# EAGLE design ArduinoShield101 (EAGLE 7.6.0)
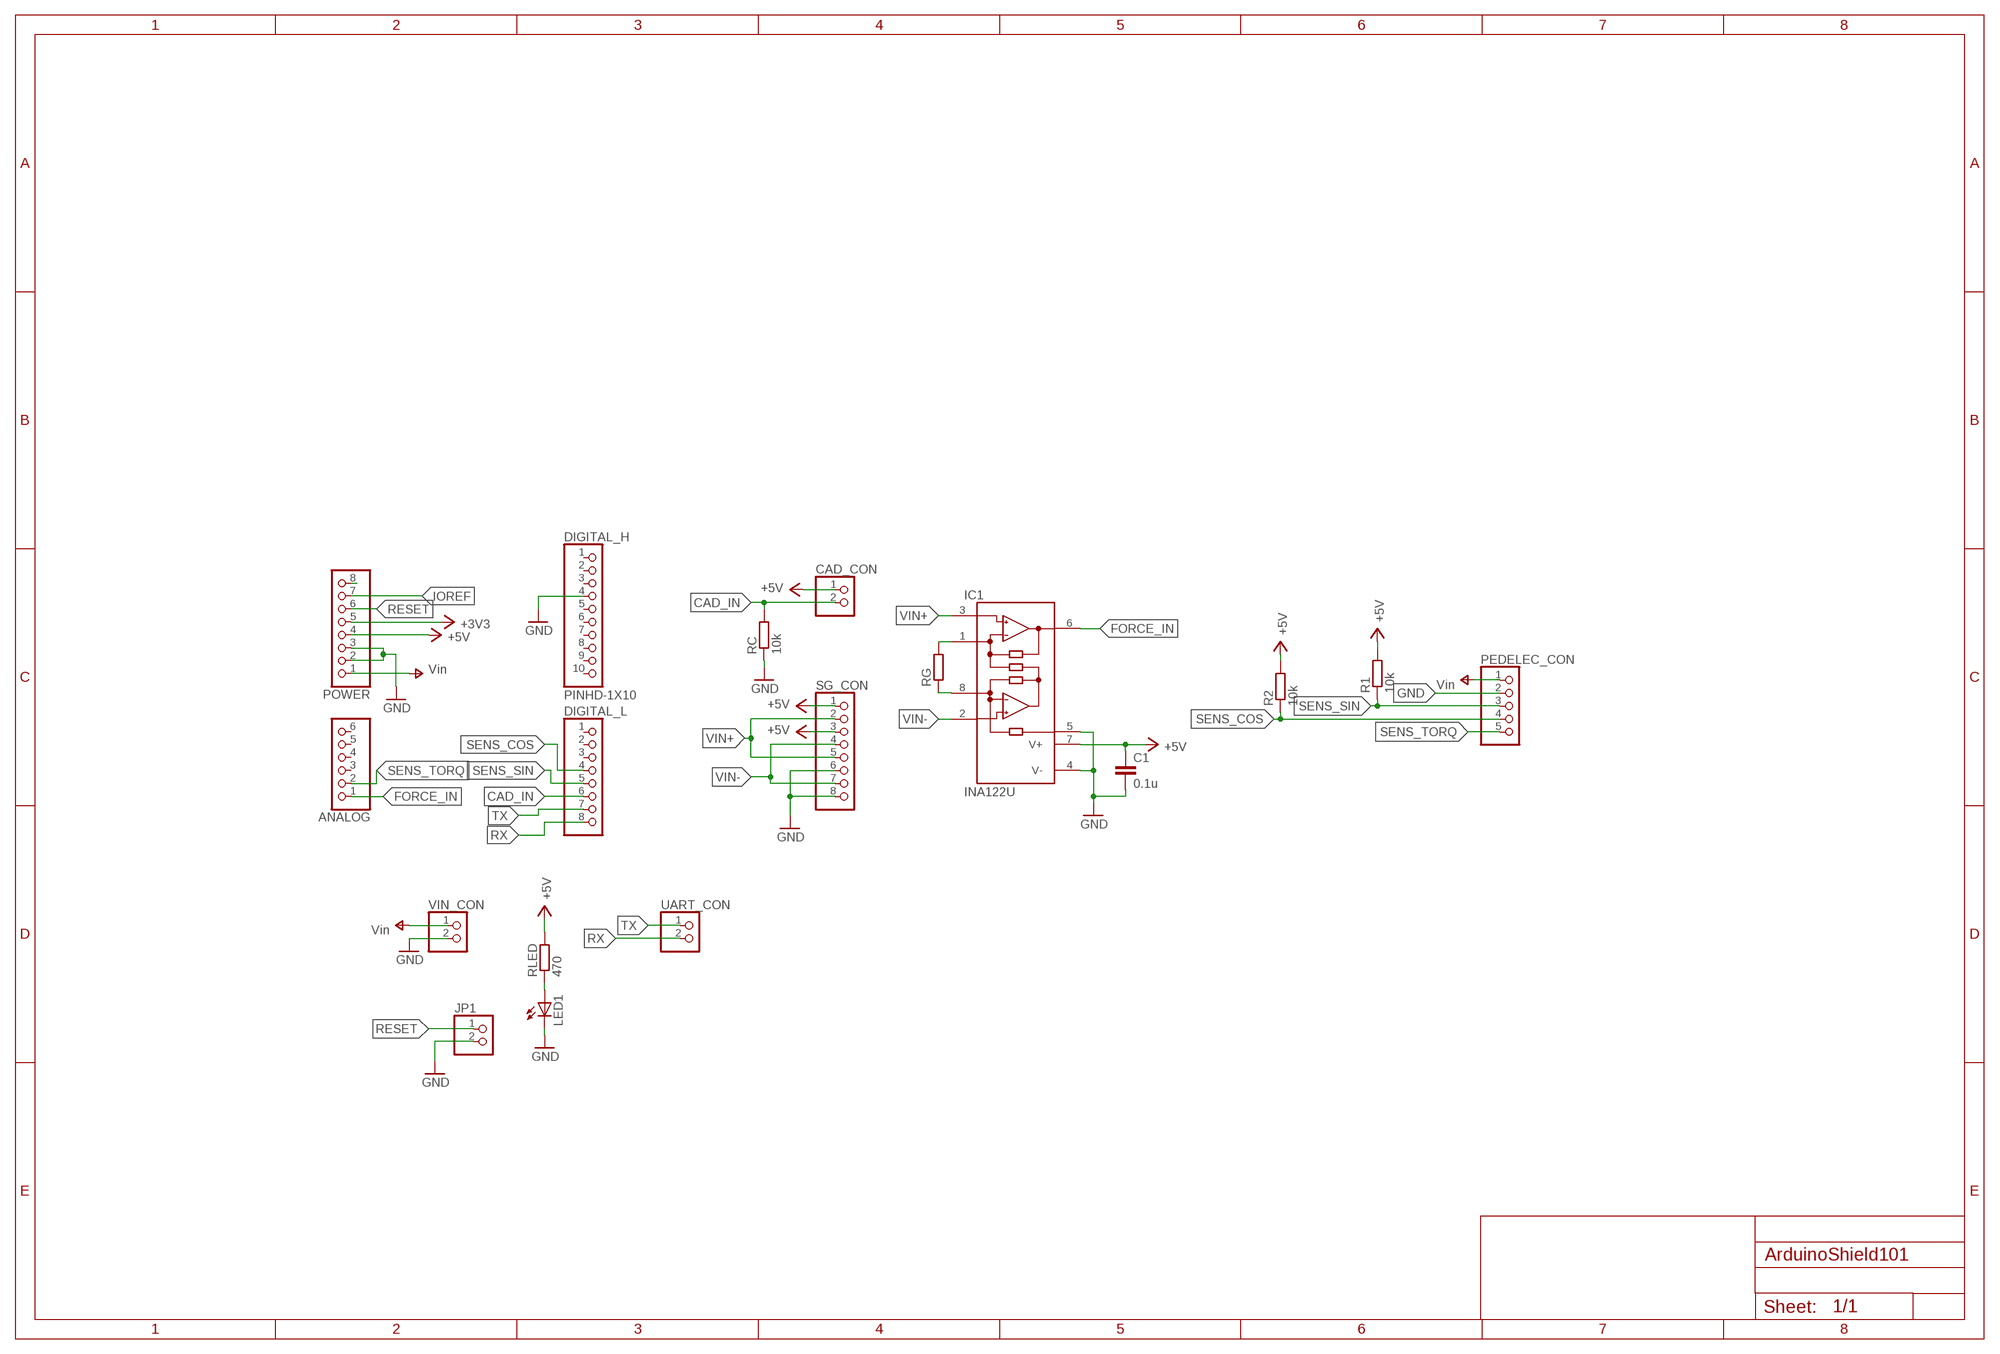
[diagram p0: schematic, sheet 1]

## Parts
ANALOG  PINHD-1X6B  [1X06-BIG]
C1  0.1u  C-EUC0603  [C0603]
CAD_CON  PINHD-1X2/90  [1X02/90]
DIGITAL_H  PINHD-1X10  [1X10-BIG]
DIGITAL_L  PINHD-1X8BIG  [1X08-BIG]
IC1  INA122U  [SO08]
JP1  PINHD-1X2  [1X02]
LED1  LEDCHIPLED_0603  [CHIPLED_0603]
PEDELEC_CON  PINHD-1X5/90  [1X05/90]
POWER  PINHD-1X8BIG  [1X08-BIG]
R1  10k  R-EU_R0603  [R0603]
R2  10k  R-EU_R0603  [R0603]
RC  10k  R-EU_R0603  [R0603]
RG  R-EU_R0603  [R0603]
RLED  470  R-EU_R0603  [R0603]
SG_CON  PINHD-1X8/90  [1X08/90]
UART_CON  PINHD-1X2/90  [1X02/90]
VIN_CON  PINHD-1X2/90  [1X02/90]

## Nets
+3V3: POWER.5
+5V [usbvcc]: C1.1 CAD_CON.1 IC1.7(V+) POWER.4 R1.2 R2.2 RLED.2 SG_CON.1 SG_CON.3
CAD_IN: CAD_CON.2 DIGITAL_L.6 RC.2
FORCE_IN: ANALOG.1 IC1.6(OUT)
GND: C1.2 DIGITAL_H.4 IC1.4(V-) IC1.5(REF) JP1.2 LED1.C PEDELEC_CON.2 POWER.2 POWER.3 RC.1 SG_CON.6 SG_CON.8 VIN_CON.2
IOREF: POWER.7
N$1: POWER.8
N$2: IC1.1(RG) RG.2
N$3: IC1.8(RG) RG.1
N$4: LED1.A RLED.1
RESET: JP1.1 POWER.6
RX: DIGITAL_L.8 UART_CON.2
SENS_COS: DIGITAL_L.4 PEDELEC_CON.4 R2.1
SENS_SIN: DIGITAL_L.5 PEDELEC_CON.3 R1.1
SENS_TORQ: ANALOG.2 PEDELEC_CON.5
TX: DIGITAL_L.7 UART_CON.1
V+ [power]: PEDELEC_CON.1 POWER.1 VIN_CON.1 ; supply symbol labelled Vin
VIN+: IC1.3(+IN) SG_CON.2 SG_CON.5
VIN-: IC1.2(-IN) SG_CON.4 SG_CON.7
Unconnected: ANALOG.3 ANALOG.4 ANALOG.5 ANALOG.6 DIGITAL_H.1 DIGITAL_H.2 DIGITAL_H.3 DIGITAL_H.5 DIGITAL_H.6 DIGITAL_H.7 DIGITAL_H.8 DIGITAL_H.9 DIGITAL_H.10 DIGITAL_L.1 DIGITAL_L.2 DIGITAL_L.3

## Library data of the parts
ANALOG = adafruit:PINHD-1X6: PIN HEADER
C1 = rcl:C-EU: CAPACITOR, European symbol
CAD_CON JP1 UART_CON VIN_CON = pinhead:PINHD-1X2: PIN HEADER
DIGITAL_H = adafruit:PINHD-1X10: Pin header 1x10 0.1" spacing With round pins
DIGITAL_L POWER = adafruit:PINHD-1X8: PIN HEADER
IC1 = burr-brown:INA122: Instrumentation Amplifier Single Supply, MicroPower; MPN: INA122U; OC_FARNELL: 1212407; OC_NEWARK: 97K1918
LED1 = adafruit:LED: LED OSRAM: - CHIPLED LG R971, LG N971, LY N971, LG Q971, LY Q971, LO R971, LY R971 LH N974, LH R974 LS Q976, LO Q976, LY Q976 LO Q996 - Hyper CHIPLED LW Q18S LB Q993, LB Q99A, LB R99A - SideLED LS A670, LO A670, LY A670, LG A670, LP A670 LB A673, LV A673, LT A673, LW A673 LH A674 LY A675 LS A676, LA A676, LO A676, LY A676, LW A676 LS A679, LY A679, LG A679 - Hyper Micro SIDELED® LS Y876, LA Y876, LO Y876, LY Y876 LT Y87S - SmartLED LW L88C, LW L88S LB L89C, LB L89S, LG L890 LS L89K, LO L89K, LY L89K LS L896, LA L896, LO L896, LY L896 - TOPLED LS T670, LO T670, LY T670, LG T670, LP T670 LSG T670, LSP T670, LSY T670, LOP T670, LYG T670 LG T671, LOG T671, LSG T671 LB T673, LV T673, LT T673, LW T673 LH T674 LS T676, LA T676, LO T676, LY T676, LB T676, LH T676, LSB T676, LW T676 LB T67C, LV T67C, LT T67C, LS T67K, LO T67K, LY T67K, LW E67C LS E67B, LA E67B, LO E67B, LY E67B, LB E67C, LV E67C, LT E67C LW T67C LS T679, LY T679, LG T679 LS T770, LO T770, LY T770, LG T770, LP T770 LB T773, LV T773, LT T773, LW T773 LH T774 LS E675, LA E675, LY E675, LS T675 LS T776, LA T776, LO T776, LY T776, LB T776 LHGB T686 LT T68C, LB T68C - Hyper Mini TOPLED® LB M676 - Mini TOPLED Santana® LG M470 LS M47K, LO M47K, LY M47K Source: http://www.osram.convergy.de/
PEDELEC_CON = pinhead:PINHD-1X5: PIN HEADER
R1 R2 RC RG RLED = rcl:R-EU_: RESISTOR, European symbol
SG_CON = pinhead:PINHD-1X8: PIN HEADER

## Net classes
0 default: width 0.203 mm, drill 0.305 mm, clearance 0.203 mm
3 usbvcc: width 0.203 mm, drill 0.305 mm, clearance 0.203 mm

## Board
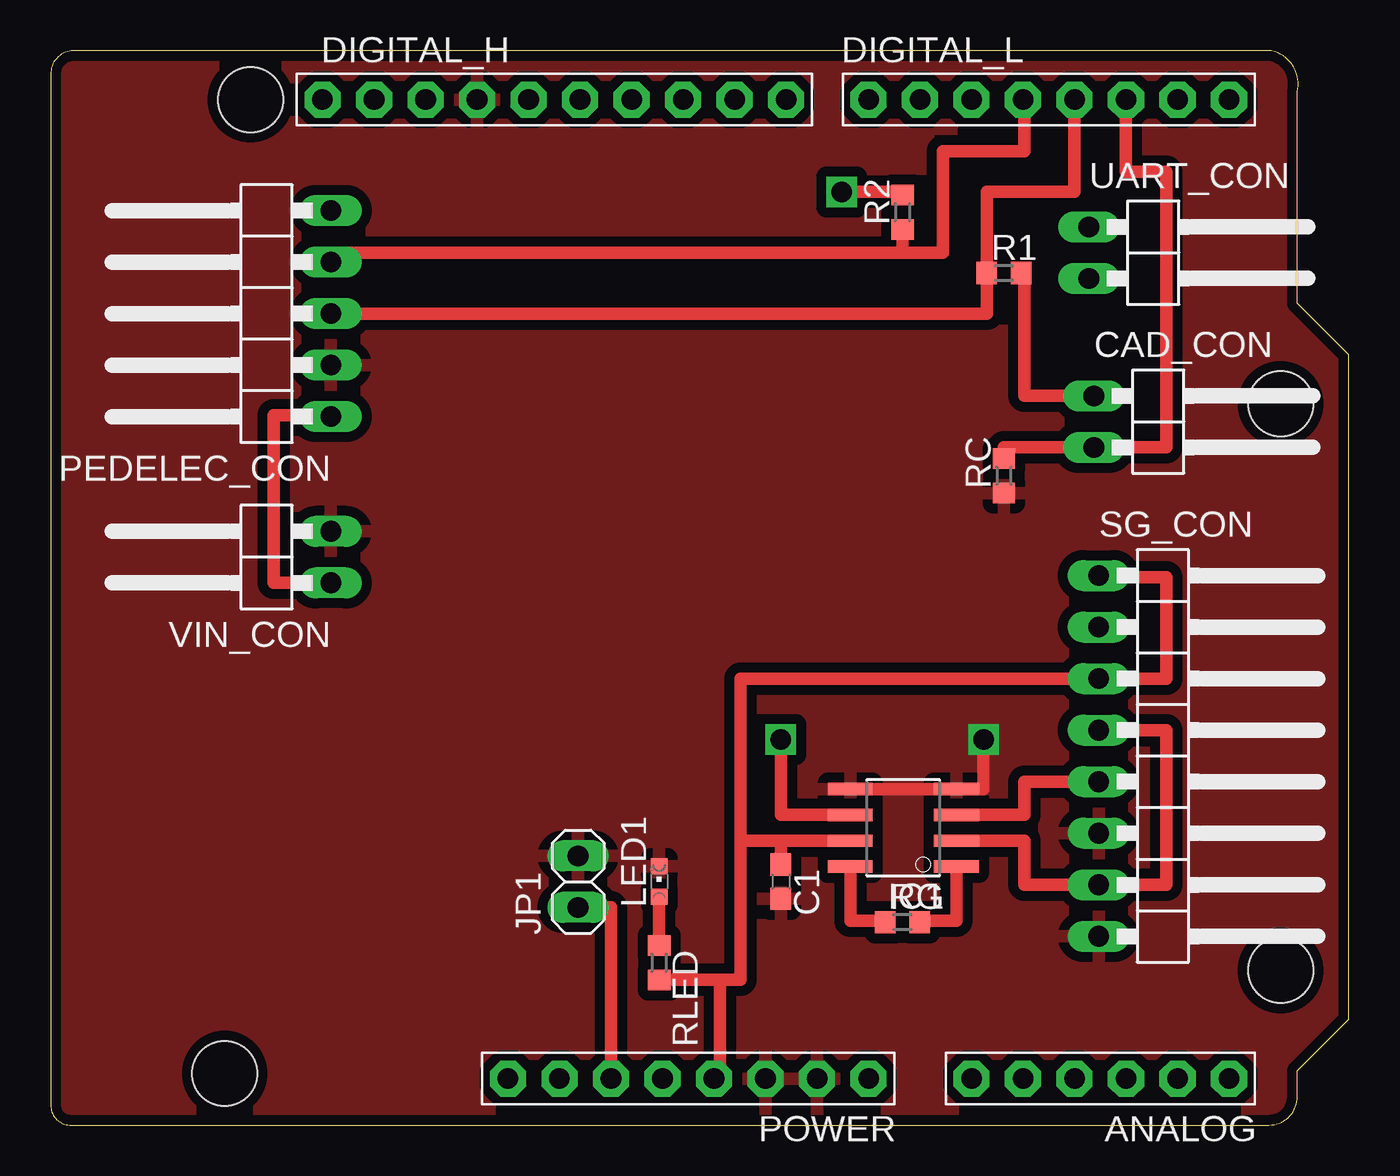
[diagram p1: board, top side]
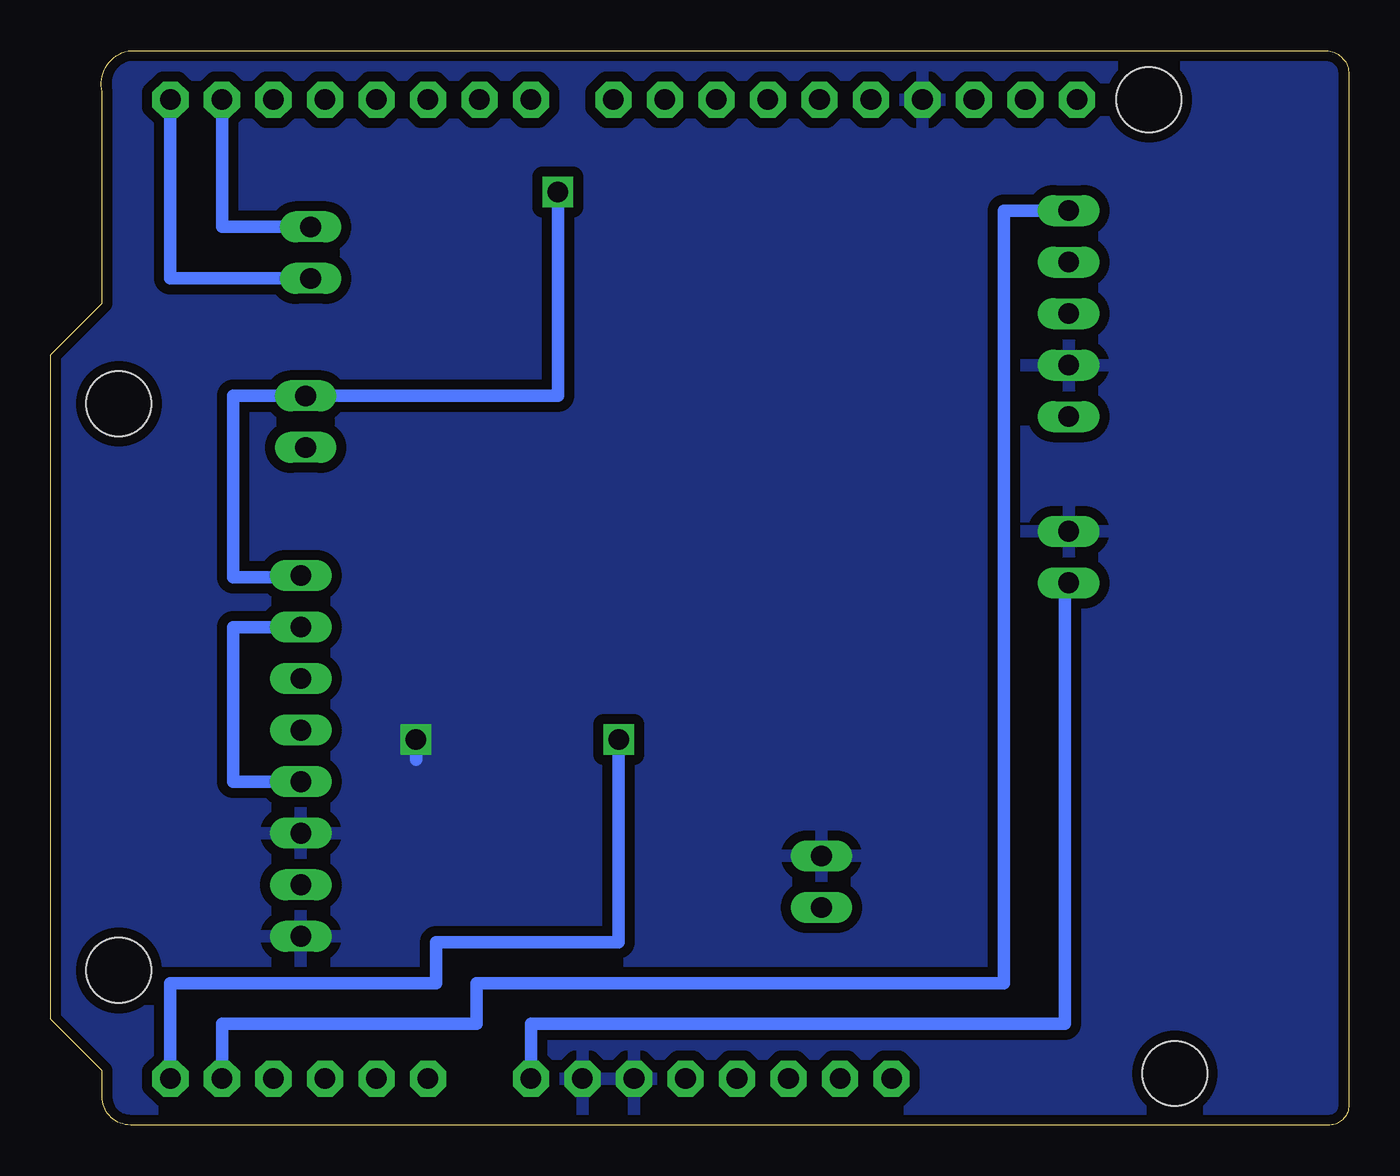
[diagram p2: board, bottom side, seen from below]

Size 64.01 x 52.96 mm. Coordinates in mm from the lower left corner, seen from the top.
Outline: 0.01,51.69 0.01,0.89 arc90 1.02,0 60.08,0 arc90 61.47,1.4 61.47,2.67 64.01,5.21 64.01,37.97 61.47,40.51 61.47,50.93 arc90 60.2,52.96 1.02,52.96 arc90 0.01,51.69
Copper layers (1*16): Top 0.035mm / dielectric 0.5mm / Bottom 0.035mm
Design rules "SeeedStudio_4layer_DRU_no_angle_20140221 *": minimum track width 0.5mm, minimum drill 0.5mm, track to track 0.5mm, track to pad 0.5mm, pad to pad 0.5mm, via to via 0.5mm, smd to smd 0.5mm, copper to edge 0.5mm, drill to drill 0.5mm, minimum pad ring 6mil, minimum via ring 4mil, stop-mask expansion 4mil, vias tented up to drill 25mil, thermal gap 0.5mm
Holes 3.2 mm at 60.65,7.62 8.58,2.54 9.85,50.55 60.65,35.56

### Footprints (pad centres in the part's own frame; a part is rotated, then mirrored left to right if it is on the bottom)
1X06-BIG = drill 1.016 pad 1.778 octagon: 1 -6.35,0; 2 -3.81,0; 3 -1.27,0; 4 1.27,0; 5 3.81,0; 6 6.35,0
C0603 = smd 1.1 x 1: 1 -0.85,0; 2 0.85,0
1X02/90 = drill 1.016 long: 1 -1.27,-3.81; 2 1.27,-3.81
1X10-BIG = drill 1.016 pad 1.778 octagon: 1 -11.43,0; 2 -8.89,0; 3 -6.35,0; 4 -3.81,0; 5 -1.27,0; 6 1.27,0; 7 3.81,0; 8 6.35,0; 9 8.89,0; 10 11.43,0
1X08-BIG = drill 1.016 pad 1.778 octagon: 1 -8.89,0; 2 -6.35,0; 3 -3.81,0; 4 -1.27,0; 5 1.27,0; 6 3.81,0; 7 6.35,0; 8 8.89,0
SO08 = smd 0.61 x 2.21: 1 -1.905,-2.616; 2 -0.635,-2.616; 3 0.635,-2.616; 4 1.905,-2.616; 5 1.905,2.616; 6 0.635,2.616; 7 -0.635,2.616; 8 -1.905,2.616
1X02 = drill 1.016 long: 1 -1.27,0; 2 1.27,0
CHIPLED_0603 = smd 0.8 x 0.8: A 0,-0.75; C 0,0.75
1X05/90 = drill 1.016 long: 1 -5.08,-3.81; 2 -2.54,-3.81; 3 0,-3.81; 4 2.54,-3.81; 5 5.08,-3.81
R0603 = smd 1 x 1.1: 1 -0.85,0; 2 0.85,0
1X08/90 = drill 1.016 long: 1 -8.89,-3.81; 2 -6.35,-3.81; 3 -3.81,-3.81; 4 -1.27,-3.81; 5 1.27,-3.81; 6 3.81,-3.81; 7 6.35,-3.81; 8 8.89,-3.81

### Placement (x,y rotation side)
ANALOG  51.76,2.29 180 top
C1  36.01,12 270 top
CAD_CON  55.25,34.67 270 top
DIGITAL_H  24.84,50.55 0 top
DIGITAL_L  49.22,50.55 0 top
IC1  42.04,14.65 90 top
JP1  26.01,12 90 top
LED1  30.01,12 0 top
PEDELEC_CON  10.01,40 90 top
POWER  31.44,2.29 180 top
R1  47.01,42 0 top
R2  42.01,45 90 top
RC  47.01,32 90 top
RG  42.01,10 0 top
RLED  30.01,8 270 top
SG_CON  55.49,18.19 270 top
UART_CON  55.01,43 270 top
VIN_CON  10.01,28 90 top

### Tracks (layer width: path | path; a pad name or v marks a point on that pad's centre or on a via)
+5V  (via drill 1)
  Top 0.61: SG_CON.1 51.68,27 55.01,27 55.01,22 SG_CON.3 34.01,22 34.01,14.02 | CAD_CON.1 48.01,35.94 48.01,42 R1.2 | IC1.7 36.01,14.02 | 36.01,14.02 34.01,14.02 | POWER.4 33.01,2.29 33.01,7.15 | C1.1 36.01,14.02 | 34.01,14.02 34.01,7.15 33.01,7.15 | 33.01,7.15 RLED.2 | R2.2 42.01,46 v39.01,46
  Bottom 0.61: SG_CON.1 51.68,27 55.01,27 55.01,35.94 CAD_CON.1 39.01,35.94 v39.01,46
CAD_IN
  Top 0.61: DIGITAL_L.6 53.03,47 55.01,47 55.01,33.4 CAD_CON.2 47.01,33.4 RC.2
FORCE_IN  (via drill 1)
  Top 0.61: v36.01,19 36.01,15.29 IC1.6
  Bottom 0.61: ANALOG.1 58.11,7 45.01,7 45.01,9 36.01,9 v36.01,19
GND  (via drill 1)
  Top 0.61: IC1.5 IC1.4 46.01,16.56 v46.01,19
  Bottom 0.61: v46.01,19 46.01,18
  pour Bottom: 0.45,52.92 64.27,53.05 64.67,0.08 -0.02,-0.05
  pour Top: 0.01,53 0.01,0 64.01,0 64.01,53
N$2
  Top 0.61: IC1.1 44.66,10.07 42.86,10.07 RG.2
N$3
  Top 0.61: IC1.8 39.43,10.07 41.16,10.07 RG.1
N$4
  Top 0.61: RLED.1 LED1.A
RESET
  Top 0.61: POWER.6 27.63,10.73 JP1.1
RX
  Bottom 0.61: UART_CON.2 58.11,41.73 DIGITAL_L.8
SENS_COS
  Top 0.61: DIGITAL_L.4 48.01,50.55 48.01,48 44.01,48 44.01,43 42.01,43 | 42.01,43 R2.1 | PEDELEC_CON.4 13.82,43 42.01,43
SENS_SIN
  Top 0.61: PEDELEC_CON.3 46.16,40 R1.1 46.16,46 50.49,46 DIGITAL_L.5
SENS_TORQ
  Bottom 0.61: ANALOG.2 55.57,5 43.01,5 43.01,7 17.01,7 17.01,45.08 PEDELEC_CON.5
TX
  Bottom 0.61: UART_CON.1 55.57,44.27 DIGITAL_L.7
V+
  Top 0.61: VIN_CON.1 11.01,26.73 11.01,35 13.82,35 PEDELEC_CON.1
  Bottom 0.61: POWER.1 40.33,5 14.01,5 14.01,26.73 VIN_CON.1
VIN+
  Top 0.61: SG_CON.5 48.01,16.92 48.01,15.29 IC1.3
  Bottom 0.61: SG_CON.2 55.01,24.54 55.01,16.92 SG_CON.5
VIN-
  Top 0.61: IC1.2 48.01,14.02 48.01,11.84 SG_CON.7 55.01,11.84 55.01,19.46 SG_CON.4